# EAGLE design sbox (EAGLE 8.6.0)
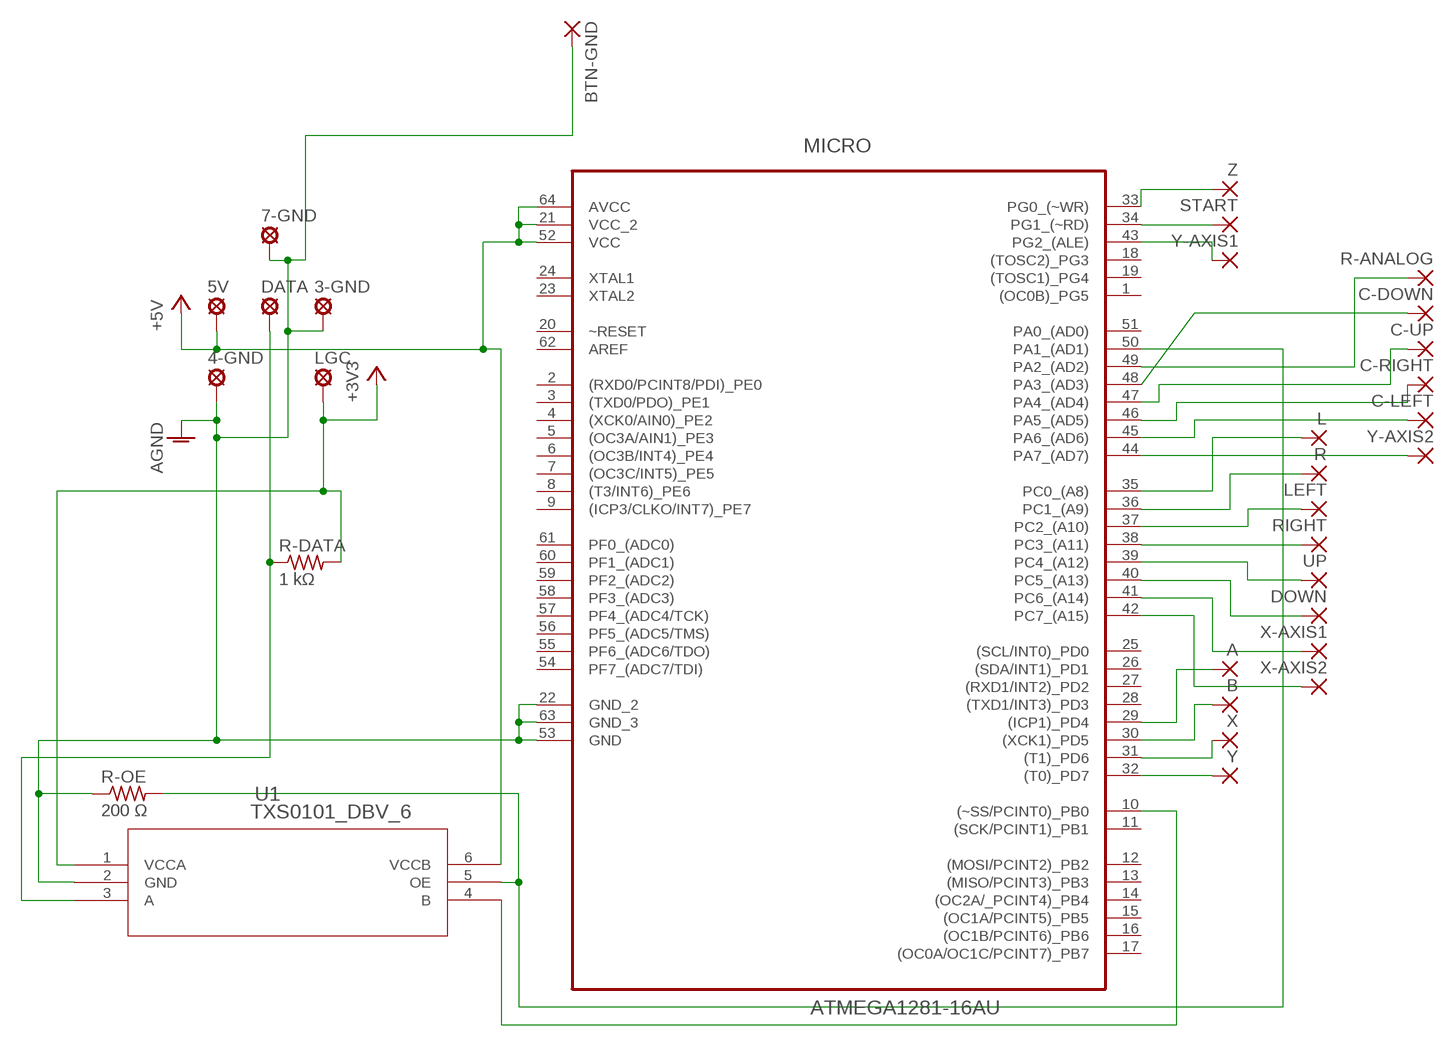
[diagram p0: schematic, sheet 1]

## Parts
3-GND  LSP10  [LSP10]
4-GND  LSP10  [LSP10]
5V  LSP10  [LSP10]
7-GND  LSP10  [LSP10]
A  1,6/0,8  [1,6/0,8]
B  1,6/0,8  [1,6/0,8]
BTN-GND  1,6/0,8  [1,6/0,8]
C-DOWN  1,6/0,8  [1,6/0,8]
C-LEFT  1,6/0,8  [1,6/0,8]
C-RIGHT  1,6/0,8  [1,6/0,8]
C-UP  1,6/0,8  [1,6/0,8]
DATA  LSP10  [LSP10]
DOWN  1,6/0,8  [1,6/0,8]
L  1,6/0,8  [1,6/0,8]
LEFT  1,6/0,8  [1,6/0,8]
LGC  LSP10  [LSP10]
MICRO  ATMEGA1281-16AU  [QFP80P1600X1600X120-64N]
R  1,6/0,8  [1,6/0,8]
R-ANALOG  1,6/0,8  [1,6/0,8]
R-DATA  1 kΩ  R-US_0207/12  [0207/12]
R-OE  200 Ω  R-US_0207/12  [0207/12]
RIGHT  1,6/0,8  [1,6/0,8]
START  1,6/0,8  [1,6/0,8]
U1  TXS0101_DBV_6  [DBV6]
UP  1,6/0,8  [1,6/0,8]
X  1,6/0,8  [1,6/0,8]
X-AXIS1  1,6/0,8  [1,6/0,8]
X-AXIS2  1,6/0,8  [1,6/0,8]
Y  1,6/0,8  [1,6/0,8]
Y-AXIS1  1,6/0,8  [1,6/0,8]
Y-AXIS2  1,6/0,8  [1,6/0,8]
Z  1,6/0,8  [1,6/0,8]

## Nets
+3V3: LGC.MP R-DATA.2 U1.1(VCCA)
+5V: 5V.MP MICRO.21(VCC_2) MICRO.52(VCC) MICRO.64(AVCC) U1.6(VCCB)
AGND: 3-GND.MP 4-GND.MP 7-GND.MP BTN-GND.1(P) MICRO.22(GND_2) MICRO.53(GND) MICRO.63(GND_3) R-OE.1 U1.2(GND)
N$1: MICRO.32((T0)_PD7) Y.1(P)
N$2: MICRO.31((T1)_PD6) X.1(P)
N$3: B.1(P) MICRO.30((XCK1)_PD5)
N$4: A.1(P) MICRO.29((ICP1)_PD4)
N$5: MICRO.33(PG0_(~WR)) Z.1(P)
N$6: MICRO.34(PG1_(~RD)) START.1(P)
N$7: L.1(P) MICRO.35(PC0_(A8))
N$8: MICRO.36(PC1_(A9)) R.1(P)
N$9: LEFT.1(P) MICRO.37(PC2_(A10))
N$10: MICRO.38(PC3_(A11)) RIGHT.1(P)
N$11: MICRO.39(PC4_(A12)) UP.1(P)
N$12: DOWN.1(P) MICRO.40(PC5_(A13))
N$13: MICRO.41(PC6_(A14)) X-AXIS1.1(P)
N$14: MICRO.42(PC7_(A15)) X-AXIS2.1(P)
N$15: MICRO.44(PA7_(AD7)) Y-AXIS2.1(P)
N$16: C-LEFT.1(P) MICRO.45(PA6_(AD6))
N$17: C-RIGHT.1(P) MICRO.46(PA5_(AD5))
N$18: C-UP.1(P) MICRO.47(PA4_(AD4))
N$19: C-DOWN.1(P) MICRO.48(PA3_(AD3))
N$20: MICRO.49(PA2_(AD2)) R-ANALOG.1(P)
N$24: MICRO.43(PG2_(ALE)) Y-AXIS1.1(P)
N$28: DATA.MP R-DATA.1 U1.3(A)
N$29: MICRO.10((~SS/PCINT0)_PB0) U1.4(B)
N$30: MICRO.50(PA1_(AD1)) R-OE.2 U1.5(OE)
Unconnected: MICRO.1((OC0B)_PG5) MICRO.2((RXD0/PCINT8/PDI)_PE0) MICRO.3((TXD0/PDO)_PE1) MICRO.4((XCK0/AIN0)_PE2) MICRO.5((OC3A/AIN1)_PE3) MICRO.6((OC3B/INT4)_PE4) MICRO.7((OC3C/INT5)_PE5) MICRO.8((T3/INT6)_PE6) MICRO.9((ICP3/CLKO/INT7)_PE7) MICRO.11((SCK/PCINT1)_PB1) MICRO.12((MOSI/PCINT2)_PB2) MICRO.13((MISO/PCINT3)_PB3) MICRO.14((OC2A/_PCINT4)_PB4) MICRO.15((OC1A/PCINT5)_PB5) MICRO.16((OC1B/PCINT6)_PB6) MICRO.17((OC0A/OC1C/PCINT7)_PB7) MICRO.18((TOSC2)_PG3) MICRO.19((TOSC1)_PG4) MICRO.20(~RESET) MICRO.23(XTAL2) MICRO.24(XTAL1) MICRO.25((SCL/INT0)_PD0) MICRO.26((SDA/INT1)_PD1) MICRO.27((RXD1/INT2)_PD2) MICRO.28((TXD1/INT3)_PD3) MICRO.51(PA0_(AD0)) MICRO.54(PF7_(ADC7/TDI)) MICRO.55(PF6_(ADC6/TDO)) MICRO.56(PF5_(ADC5/TMS)) MICRO.57(PF4_(ADC4/TCK)) MICRO.58(PF3_(ADC3)) MICRO.59(PF2_(ADC2)) MICRO.60(PF1_(ADC1)) MICRO.61(PF0_(ADC0)) MICRO.62(AREF)

## Library data of the parts
3-GND 4-GND 5V 7-GND DATA LGC = solpad:LSP10: SOLDER PAD drill 1.0 mm, distributor Buerklin, 12H555
A B BTN-GND C-DOWN C-LEFT C-RIGHT C-UP DOWN L LEFT R R-ANALOG RIGHT START UP X X-AXIS1 X-AXIS2 Y Y-AXIS1 Y-AXIS2 Z = wirepad:1,6/0,8: THROUGH-HOLE PAD
MICRO = Atmel_By_element14_Batch_1-00:ATMEGA1281-16AU: Microcontroller; DESCRIPTION: Microcontroller; MPN: ATMEGA1281-16AU; OC_FARNELL: 1455092; OC_NEWARK: 58M3721; PACKAGE: QFP-64; SUPPLIER: ATMEL
R-DATA R-OE = resistor:R-US_: RESISTOR, American symbol
U1 = txs0101:TXS0101_DBV_6; DATASHEETURL: httpwww.ti.comlitgpnTXS0101; FAMILY_NAME: AUTO DIRECTION SENSING DUAL SUPPLY TRANSLATOR; GENERIC_PART_NUMBER: TXS0101; INDUSTRY_STD_PKG_TYPE: SOT23; MANUFACTURER: Texas Instruments; MANUFACTURER_PART_NUMBER: txs0101_dbv_6; PACKAGE_DESIGNATOR: DBV; PIN_COUNT: 6; VENDOR: Texas Instruments

## Board
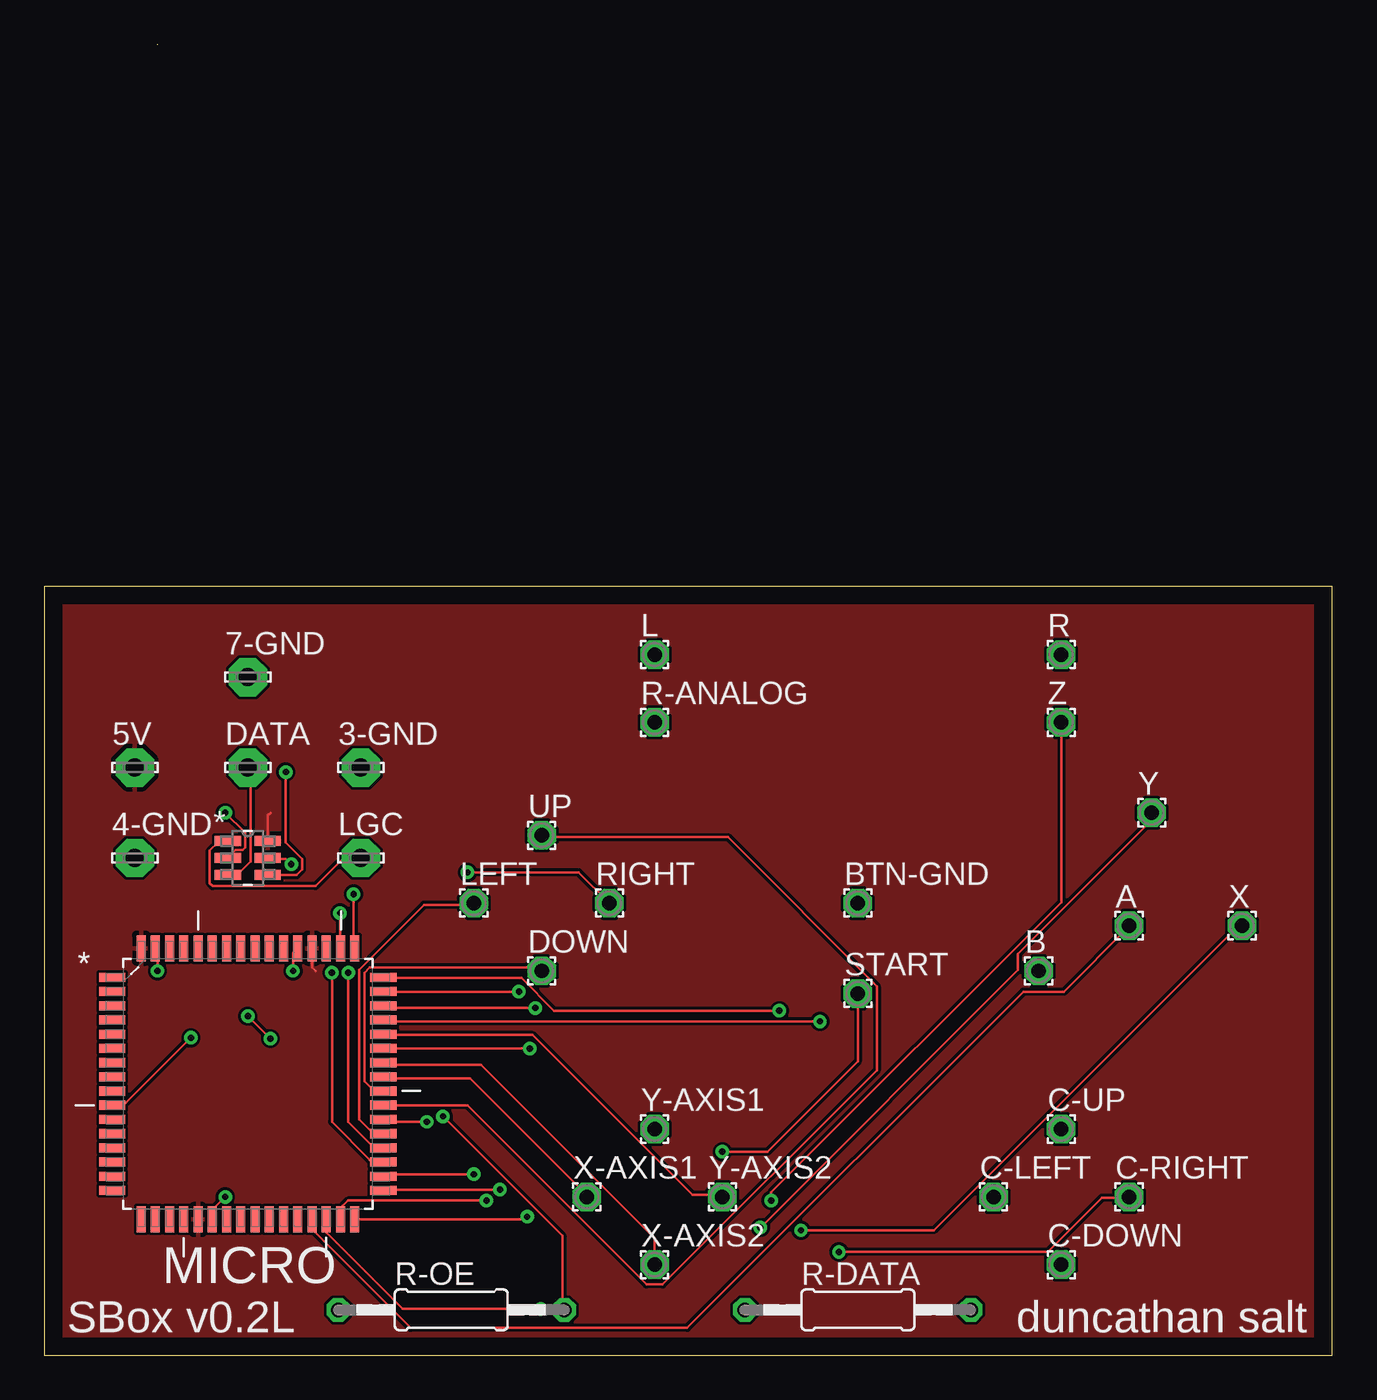
[diagram p1: board, top side]
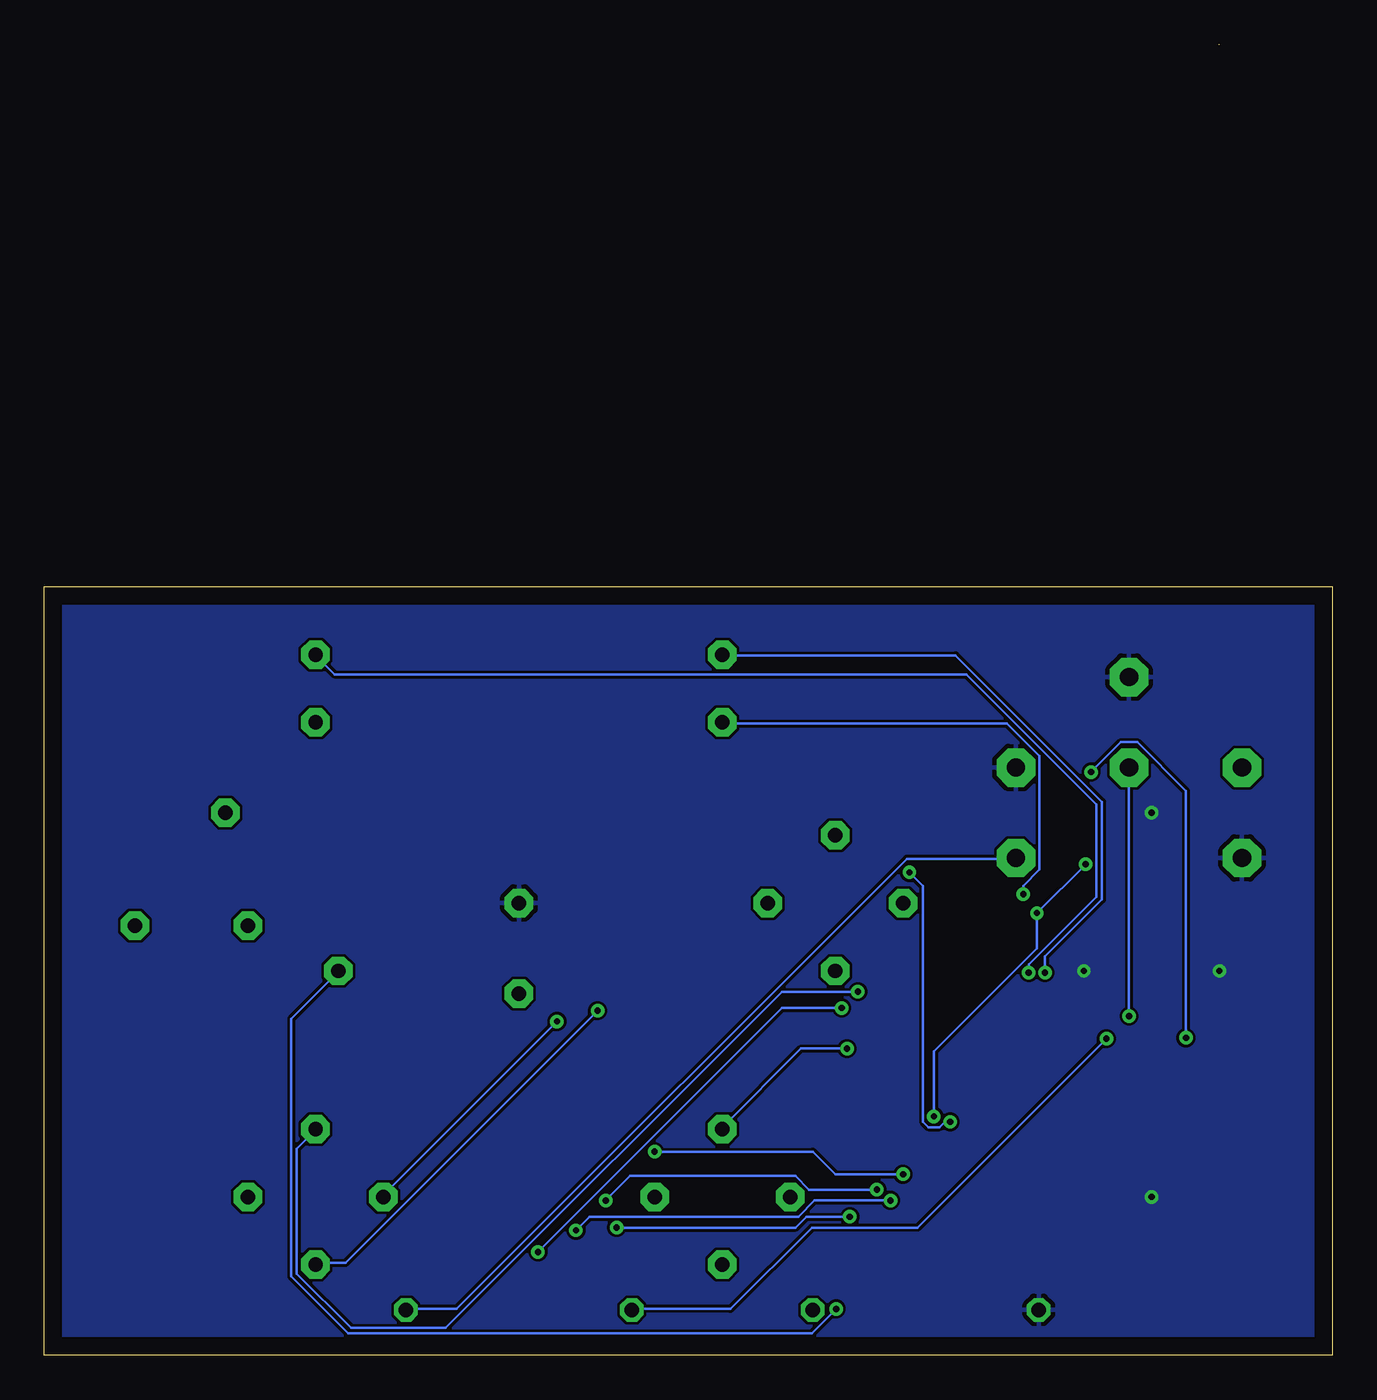
[diagram p2: board, bottom side, seen from below]

Size 72.39 x 73.66 mm. Coordinates in mm from the lower left corner, seen from the top.
Outline: 6.35,73.64 6.35,73.66
Outline: 0,0 72.39,0 72.39,43.18 0,43.18 0,0
Copper layers (1*16): Top 0.035mm / dielectric 1.5mm / Bottom 0.035mm
Design rules "default": minimum track width 6mil, minimum drill 0.35mm, track to track 6mil, track to pad 6mil, pad to pad 6mil, via to via 6mil, smd to smd 6mil, copper to edge 40mil, drill to drill 6mil, minimum pad ring 10mil, minimum via ring 8mil, stop-mask expansion 4mil, vias tented up to drill 0mil, thermal gap 10mil

### Footprints (pad centres in the part's own frame; a part is rotated, then mirrored left to right if it is on the bottom)
LSP10 = drill 1.016 pad 2.159 octagon: MP 0,0
1,6/0,8 = drill 0.813 pad 1.6 octagon: 1 0,0
QFP80P1600X1600X120-64N = smd 1.473 x 0.508: 1 -7.62,5.994; 2 -7.62,5.207; 3 -7.62,4.394; 4 -7.62,3.607; 5 -7.62,2.794; 6 -7.62,2.007; 7 -7.62,1.194; 8 -7.62,0.406; 9 -7.62,-0.406; 10 -7.62,-1.194; 11 -7.62,-2.007; 12 -7.62,-2.794; 13 -7.62,-3.607; 14 -7.62,-4.394; 15 -7.62,-5.207; 16 -7.62,-5.994; 33 7.62,-5.994; 34 7.62,-5.207; 35 7.62,-4.394; 36 7.62,-3.607; 37 7.62,-2.794; 38 7.62,-2.007; 39 7.62,-1.194; 40 7.62,-0.406; 41 7.62,0.406; 42 7.62,1.194; 43 7.62,2.007; 44 7.62,2.794; 45 7.62,3.607; 46 7.62,4.394; 47 7.62,5.207; 48 7.62,5.994 | smd 0.508 x 1.473: 17 -5.994,-7.62; 18 -5.207,-7.62; 19 -4.394,-7.62; 20 -3.607,-7.62; 21 -2.794,-7.62; 22 -2.007,-7.62; 23 -1.194,-7.62; 24 -0.406,-7.62; 25 0.406,-7.62; 26 1.194,-7.62; 27 2.007,-7.62; 28 2.794,-7.62; 29 3.607,-7.62; 30 4.394,-7.62; 31 5.207,-7.62; 32 5.994,-7.62; 49 5.994,7.62; 50 5.207,7.62; 51 4.394,7.62; 52 3.607,7.62; 53 2.794,7.62; 54 2.007,7.62; 55 1.194,7.62; 56 0.406,7.62; 57 -0.406,7.62; 58 -1.194,7.62; 59 -2.007,7.62; 60 -2.794,7.62; 61 -3.607,7.62; 62 -4.394,7.62; 63 -5.207,7.62; 64 -5.994,7.62
0207/12 = drill 0.813 octagon: 1 -6.35,0; 2 6.35,0
DBV6 = smd 1.473 x 0.559: 1 -1.118,0.95; 2 -1.118,0; 3 -1.118,-0.95; 4 1.118,-0.95; 5 1.118,0; 6 1.118,0.95

### Placement (x,y rotation side)
3-GND  17.78,33.02 0 top
4-GND  5.08,27.94 0 top
5V  5.08,33.02 0 top
7-GND  11.43,38.1 0 top
A  60.96,24.13 0 top
B  55.88,21.59 0 top
BTN-GND  45.72,25.4 0 top
C-DOWN  57.15,5.08 0 top
C-LEFT  53.34,8.89 0 top
C-RIGHT  60.96,8.89 0 top
C-UP  57.15,12.7 0 top
DATA  11.43,33.02 0 top
DOWN  27.94,21.59 0 top
L  34.29,39.37 0 top
LEFT  24.13,25.4 0 top
LGC  17.78,27.94 0 top
MICRO  11.43,15.24 0 top
R  57.15,39.37 0 top
R-ANALOG  34.29,35.56 0 top
R-DATA  45.72,2.54 0 top
R-OE  22.86,2.54 0 top
RIGHT  31.75,25.4 0 top
START  45.72,20.32 0 top
U1  11.43,27.94 0 top
UP  27.94,29.21 0 top
X  67.31,24.13 0 top
X-AXIS1  30.48,8.89 0 top
X-AXIS2  34.29,5.08 0 top
Y  62.23,30.48 0 top
Y-AXIS1  34.29,12.7 0 top
Y-AXIS2  38.1,8.89 0 top
Z  57.15,35.56 0 top

### Tracks (layer width: path | path; a pad name or v marks a point on that pad's centre or on a via)
+3V3
  Top 0.152: U1.1 10.21,28.8 9.75,28.8 9.3,28.35 9.3,26.52 9.45,26.36 15.24,26.36 16.76,27.89 17.68,27.89 LGC.MP
  Bottom 0.152: R-DATA.2 51.97,2.59 49.23,2.59 23.93,27.89 17.83,27.89 LGC.MP
+5V
  Top 0.152: 8.53,8.23 8.53,7.62 MICRO.21 | U1.6 12.55,30.33 12.7,30.48 | MICRO.52 15.04,21.79 15.24,21.59
  pour Top: 0,43.18 0,0 72.39,0 72.39,43.18
AGND  (via drill 0.35)
  Top 0.152: 9.45,7.01 9.45,7.62 MICRO.22 9.42,8.15 v10.16,8.89 | 10.82,28.04 10.36,28.04 U1.2 10.75,28.38 11.14,28.38 11.28,28.52 11.28,29.36 v10.16,30.48 | MICRO.63 6.35,22.73 v6.35,21.59 | MICRO.53 13.97,22.61 v13.97,21.59
  pour Bottom (rank 6): 0,43.18 0,0 72.39,0 72.39,43.18
N$1  (via drill 0.35)
  Top 0.152: MICRO.32 26.98,7.62 v27.13,7.77 | v40.23,7.16 54.71,21.64 54.71,22.55 62.18,30.02 62.18,30.48 Y.1
  Bottom 0.152: v27.13,7.77 29.57,7.77 30.18,7.16 v40.23,7.16
N$2  (via drill 0.35)
  Top 0.152: v24.84,8.69 17.07,8.69 16.76,8.38 16.76,7.62 MICRO.31 | v42.52,7.01 49.99,7.01 67.21,24.23 X.1
  Bottom 0.152: v24.84,8.69 29.11,8.69 30.02,7.77 41.76,7.77 v42.52,7.01
N$3  (via drill 0.35)
  Top 0.152: v27.89,2.59 20.12,2.59 15.85,6.86 15.85,7.62 MICRO.30
  Bottom 0.152: v27.89,2.59 29.26,1.22 55.32,1.22 58.52,4.42 58.52,18.9 55.93,21.49 B.1
N$4
  Top 0.152: MICRO.29 15.09,7.62 15.09,7.01 20.57,1.52 36.12,1.52 55.02,20.42 57.3,20.42 60.96,24.08 A.1
N$5  (via drill 0.35)
  Top 0.152: v25.6,9.3 19.05,9.3 MICRO.33 | v40.84,8.69 40.84,9.14 57.15,25.45 Z.1
  Bottom 0.152: v25.6,9.3 29.41,9.3 30.18,10.06 39.47,10.06 v40.84,8.69
N$6  (via drill 0.35)
  Top 0.152: v24.13,10.16 19.05,10.16 MICRO.34 | v38.1,11.43 40.64,11.43 45.72,16.51 START.1
  Bottom 0.152: v24.13,10.16 27.94,10.16 29.21,11.43 v38.1,11.43
N$7  (via drill 0.35)
  Top 0.152: v16.15,21.49 16.15,13.11 18.29,10.97 19.05,10.97 MICRO.35
  Bottom 0.152: v16.15,21.49 16.15,22.4 12.95,25.6 12.95,31.09 21.18,39.32 34.29,39.32 L.1
N$8  (via drill 0.35)
  Top 0.152: v17.07,21.49 17.07,13.11 18.44,11.73 19.05,11.73 MICRO.36
  Bottom 0.152: v17.07,21.49 17.07,21.95 13.26,25.76 13.26,30.94 20.57,38.25 56.08,38.25 57.15,39.32 R.1
N$9
  Top 0.152: MICRO.37 19.05,12.5 18.44,12.5 17.68,13.26 17.68,21.64 21.34,25.3 24.08,25.3 LEFT.1
N$10  (via drill 0.35)
  Top 0.152: v21.49,13.11 19.05,13.11 MICRO.38 | v23.77,27.13 30.02,27.13 RIGHT.1
  Bottom 0.152: v21.49,13.11 21.79,13.11 22.1,12.8 22.71,12.8 23.01,13.11 23.01,26.36 v23.77,27.13
N$11
  Top 0.152: MICRO.39 19.05,14.02 23.77,14.02 33.83,3.96 34.75,3.96 46.79,16 46.79,20.73 38.41,29.11 28.04,29.11 UP.1
N$12
  Top 0.152: DOWN.1 27.74,21.79 18.29,21.79 17.98,21.49 17.98,15.39 18.44,14.94 19.05,14.94 MICRO.40
N$13
  Top 0.152: MICRO.41 19.05,15.54 23.93,15.54 30.48,8.99 X-AXIS1.1
N$14
  Top 0.152: X-AXIS2.1 34.29,6.55 24.54,16.31 19.05,16.31 MICRO.42
N$15
  Top 0.152: MICRO.44 19.05,17.98 27.43,17.98 36.42,8.99 38.1,8.99 Y-AXIS2.1
N$16  (via drill 0.35)
  Top 0.152: v43.59,18.75 19.05,18.75 MICRO.45
  Bottom 0.152: v43.59,18.75 53.34,8.99 C-LEFT.1
N$17  (via drill 0.35)
  Top 0.152: v27.58,19.51 19.05,19.51 MICRO.46 | v44.65,5.79 56.39,5.79 59.44,8.84 60.96,8.84 C-RIGHT.1
  Bottom 0.152: v27.58,19.51 30.94,19.51 v44.65,5.79
N$18  (via drill 0.35)
  Top 0.152: v26.67,20.42 19.05,20.42 MICRO.47
  Bottom 0.152: v26.67,20.42 30.94,20.42 49.84,1.52 55.17,1.52 58.22,4.57 58.22,11.58 57.15,12.65 C-UP.1
N$19  (via drill 0.35)
  Top 0.152: v41.3,19.36 28.65,19.36 26.82,21.18 19.05,21.18 MICRO.48
  Bottom 0.152: v41.3,19.36 55.47,5.18 57.15,5.18 C-DOWN.1
N$20  (via drill 0.35)
  Top 0.152: v17.37,25.91 17.37,22.86 MICRO.49
  Bottom 0.152: v17.37,25.91 17.37,26.36 16.46,27.28 16.46,33.68 18.29,35.51 34.29,35.51 R-ANALOG.1
N$24  (via drill 0.35)
  Top 0.152: v27.28,17.22 19.05,17.22 MICRO.43
  Bottom 0.152: v27.28,17.22 29.87,17.22 34.29,12.8 Y-AXIS1.1
N$28  (via drill 0.35)
  Top 0.152: U1.3 10.36,27.13 10.97,27.13 11.58,27.74 11.58,32.77 11.43,32.92 DATA.MP | v11.43,19.05 v12.7,17.78
  Bottom 0.152: v12.7,17.78 23.32,7.16 29.26,7.16 33.83,2.59 39.32,2.59 R-DATA.1 | DATA.MP v11.43,19.05
N$29  (via drill 0.35)
  Top 0.152: v8.23,17.83 4.57,14.17 3.81,14.17 MICRO.10 | v13.56,32.77 13.56,28.8 14.48,27.89 14.48,27.28 14.17,26.98 12.65,26.98 U1.4
  Bottom 0.152: v8.23,17.83 8.23,31.7 10.97,34.44 11.89,34.44 v13.56,32.77
N$30  (via drill 0.35)
  Top 0.152: v13.87,27.58 13.56,27.89 12.65,27.89 U1.5 | v16.61,24.84 16.61,22.86 MICRO.50 | v22.4,13.41 29.11,6.71 29.11,2.59 R-OE.2
  Bottom 0.152: v13.87,27.58 v16.61,24.84 16.61,22.86 22.4,17.07 v22.4,13.41

### Text on the board
tNames: SBox v0.2L | duncathan salt